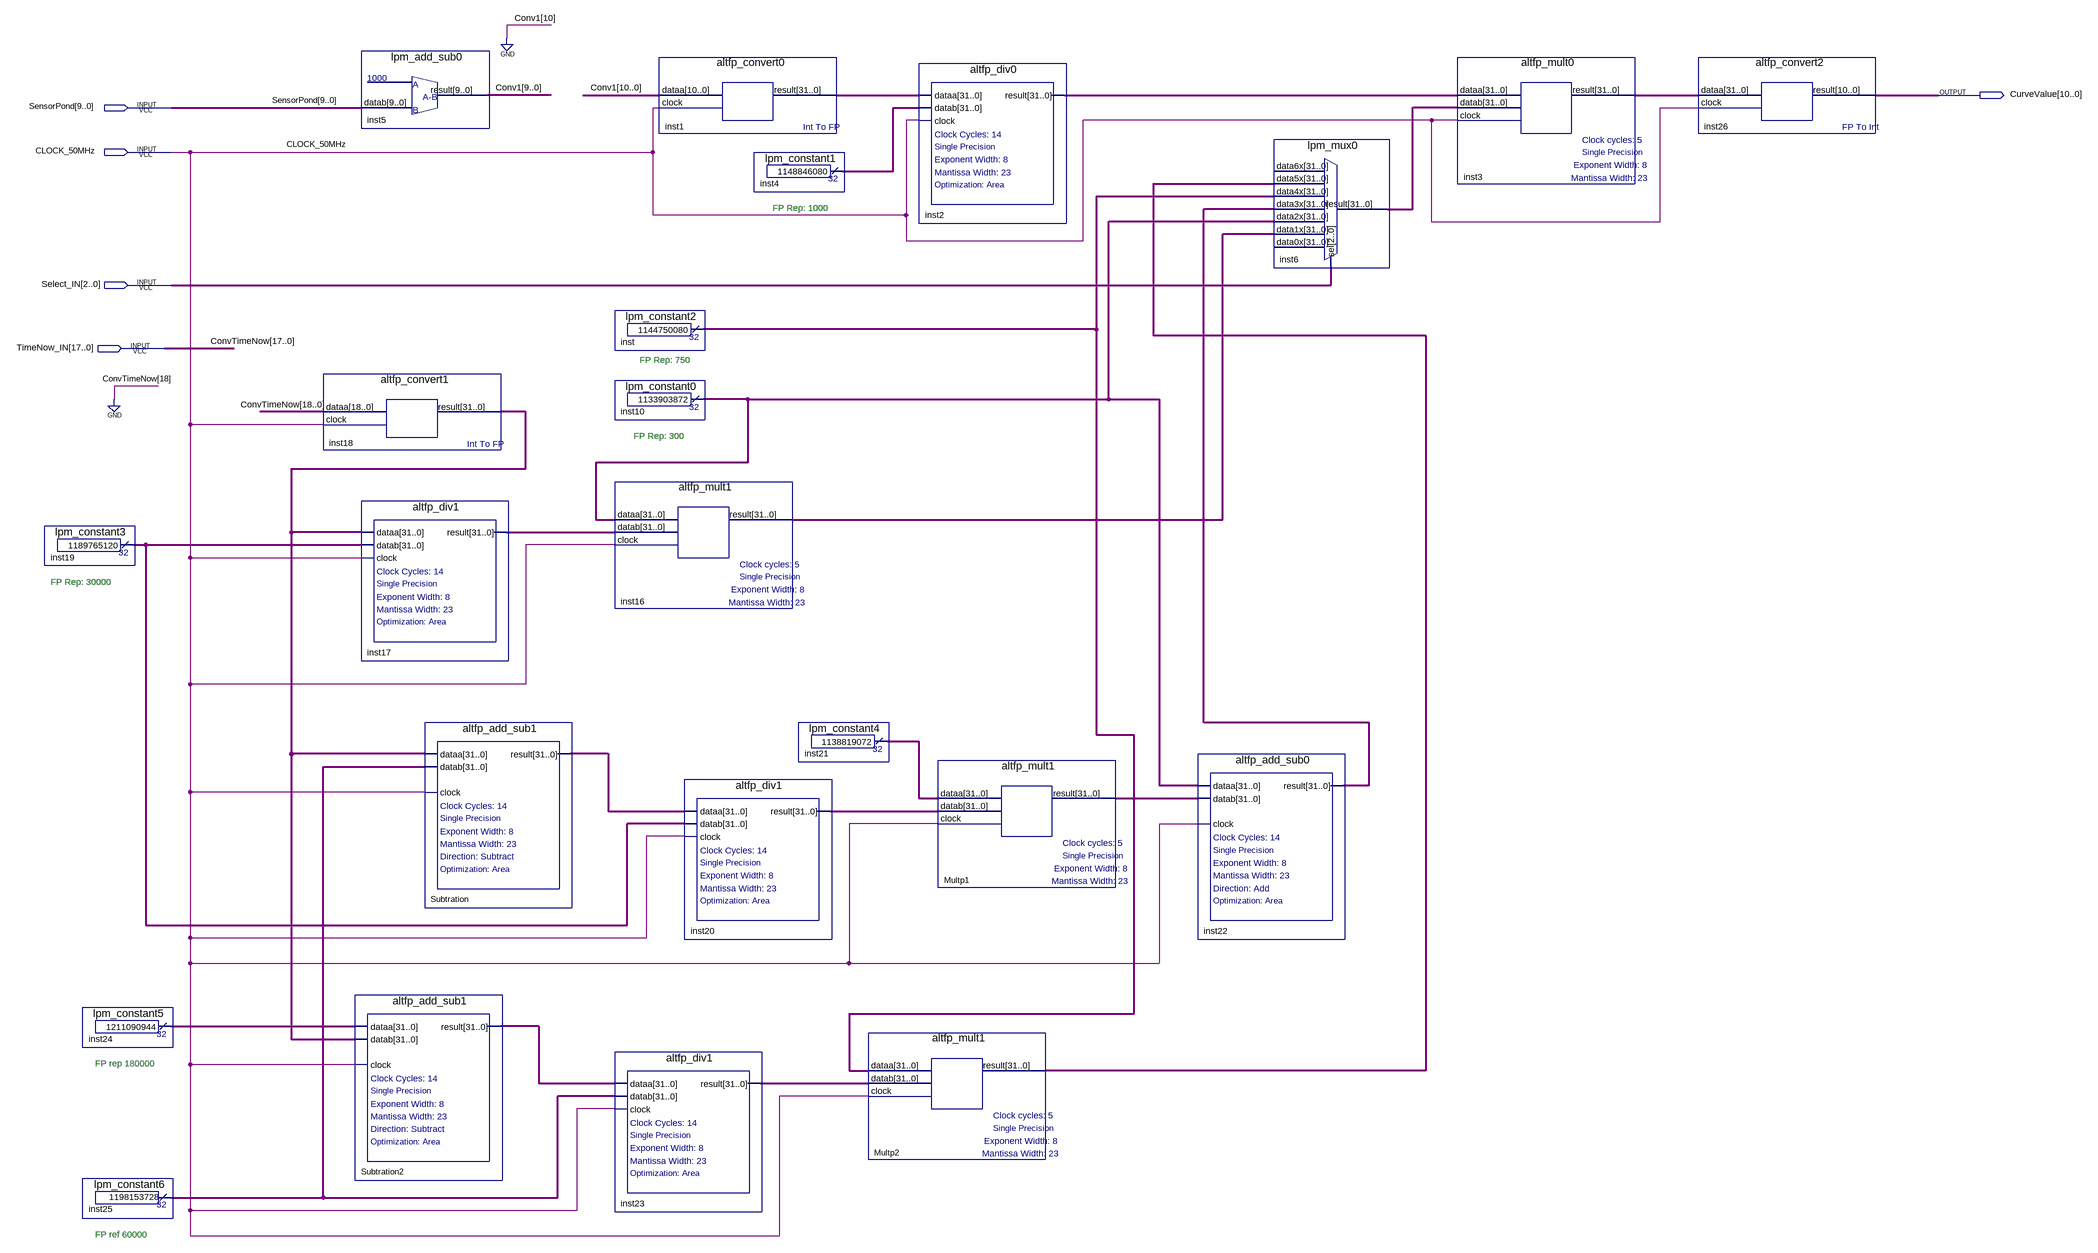
[diagram p0: schematic sheet]
// Quartus schematic CurveValues.bdf as structural Verilog: 23 symbols, 5 pins
module CurveValues (
  input  [9:0] SensorPond,
  input  CLOCK_50MHz,
  input  [2:0] Select_IN,
  input  [17:0] TimeNow_IN,
  output [10:0] CurveValue
);

  wire [9:0] Conv1;
  wire [31:0] inst1_result, inst2_result, inst3_result, inst4_result, inst6_result, inst10_result,
       inst16_result, inst17_result, inst18_result, inst19_result, inst20_result, inst21_result,
       inst22_result, inst23_result, inst24_result, inst25_result, inst_result, Multp1_result, Multp2_result,
       Subtration2_result, Subtration_result;

  lpm_constant3 inst19 (.result(inst19_result));
  lpm_constant5 inst24 (.result(inst24_result));
  lpm_constant6 inst25 (.result(inst25_result));
  altfp_convert1 inst18 (.dataa({1'b0, TimeNow_IN}), .clock(CLOCK_50MHz), .result(inst18_result));
  lpm_add_sub0 inst5 (.datab(SensorPond), .result(Conv1));
  altfp_div1 inst17 (.dataa(inst18_result), .datab(inst19_result), .clock(CLOCK_50MHz), .result(inst17_result));
  altfp_add_sub1 Subtration2 (
    .dataa(inst24_result), .datab(inst18_result), .clock(CLOCK_50MHz), .result(Subtration2_result));
  altfp_add_sub1 Subtration (
    .dataa(inst18_result), .datab(inst25_result), .clock(CLOCK_50MHz), .result(Subtration_result));
  lpm_constant2 inst (.result(inst_result));
  lpm_constant0 inst10 (.result(inst10_result));
  altfp_mult1 inst16 (.dataa(inst10_result), .datab(inst17_result), .clock(CLOCK_50MHz), .result(inst16_result));
  altfp_div1 inst23 (.dataa(Subtration2_result), .datab(inst25_result), .clock(CLOCK_50MHz), .result(inst23_result));
  altfp_convert0 inst1 (.dataa({1'b0, Conv1}), .clock(CLOCK_50MHz), .result(inst1_result));
  altfp_div1 inst20 (.dataa(Subtration_result), .datab(inst19_result), .clock(CLOCK_50MHz), .result(inst20_result));
  lpm_constant1 inst4 (.result(inst4_result));
  lpm_constant4 inst21 (.result(inst21_result));
  altfp_mult1 Multp2 (.dataa(inst_result), .datab(inst23_result), .clock(CLOCK_50MHz), .result(Multp2_result));
  altfp_div0 inst2 (.dataa(inst1_result), .datab(inst4_result), .clock(CLOCK_50MHz), .result(inst2_result));
  altfp_mult1 Multp1 (.dataa(inst21_result), .datab(inst20_result), .clock(CLOCK_50MHz), .result(Multp1_result));
  altfp_add_sub0 inst22 (.dataa(inst10_result), .datab(Multp1_result), .clock(CLOCK_50MHz), .result(inst22_result));
  lpm_mux0 inst6 (
    .data5x(Multp2_result), .data4x(inst_result), .data3x(inst22_result), .data2x(inst10_result),
    .data1x(inst16_result), .sel(Select_IN), .result(inst6_result));  // open: data6x, data0x
  altfp_mult0 inst3 (.dataa(inst2_result), .datab(inst6_result), .clock(CLOCK_50MHz), .result(inst3_result));
  altfp_convert2 inst26 (.dataa(inst3_result), .clock(CLOCK_50MHz), .result(CurveValue));

  // Other names for the same wires on the sheet: ConvTimeNow[17:0] = TimeNow_IN

  // Notes on the sheet:
  //   FP Rep: 1000
  //   FP Rep: 750
  //   FP Rep: 300
  //   FP Rep: 30000
  //   FP rep 180000
  //   FP ref 60000
endmodule
